# Altium schematic sheet Вариант7.SchDoc
size A4; SheetNumber: 7; SheetTotal: 10
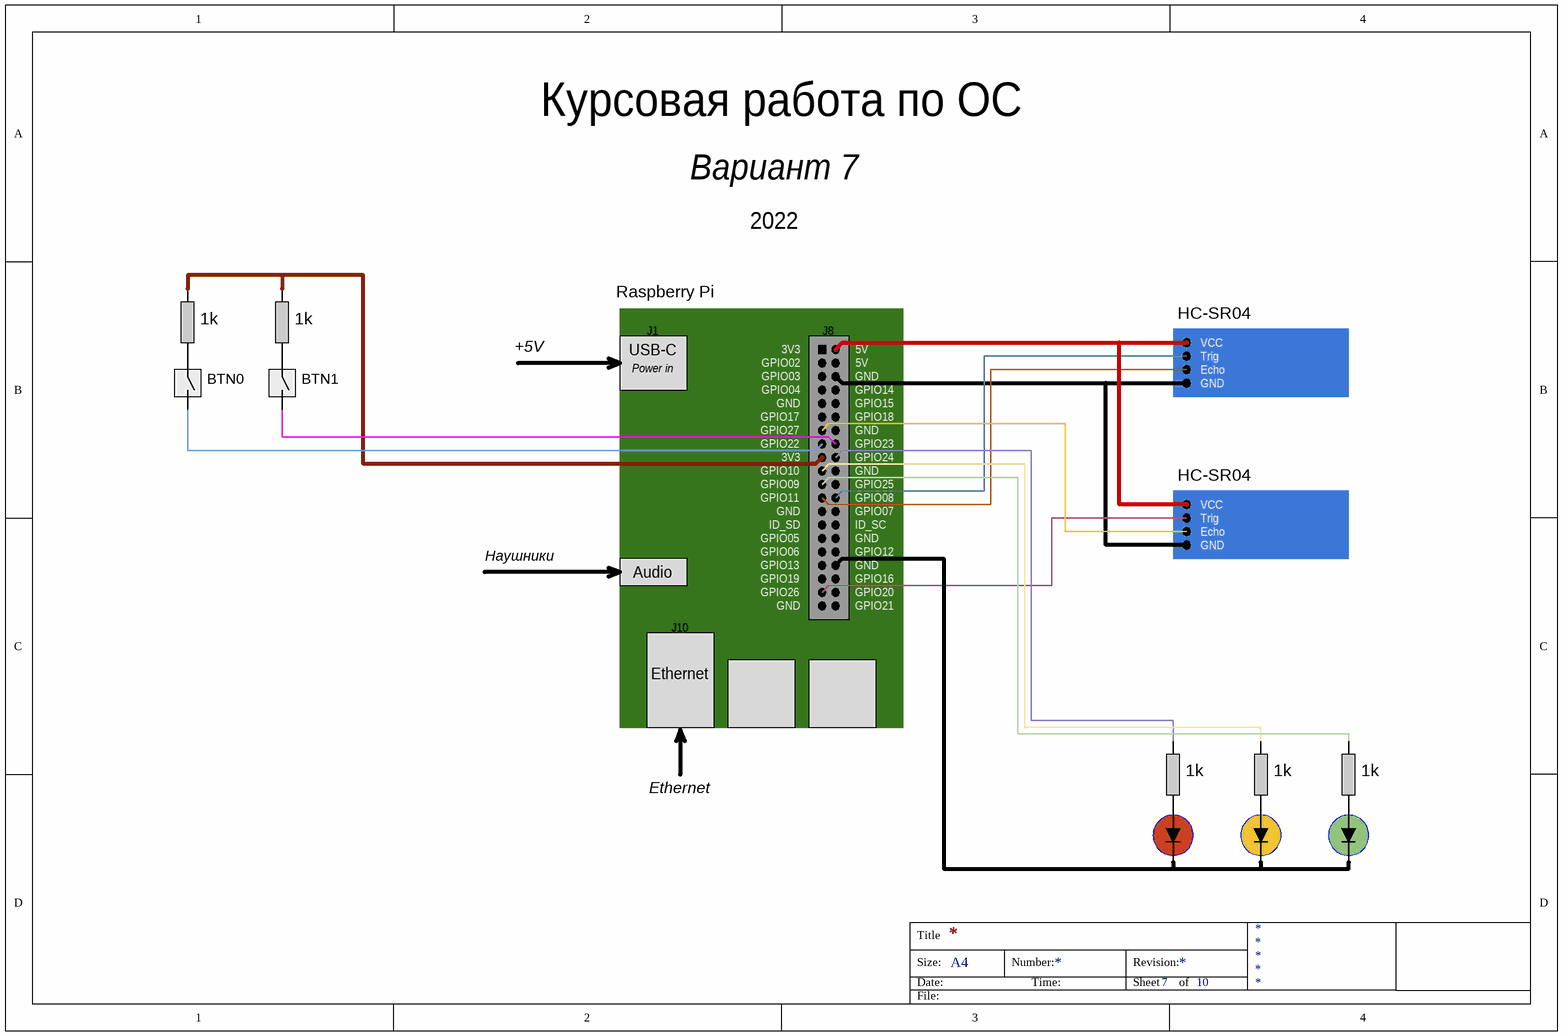
[diagram p0: Вариант7.SchDoc]

## Notes on the sheet
- Курсовая работа по ОС
- Вариант 7
- 2022
- 1k
- Raspberry Pi
- HC-SR04
- BTN0
- BTN1
- +5V
- USB-C
- Power in
- J1
- 3V3
- GPIO02
- GPIO03
- GPIO04
- J8
- GND
- GPIO14
- 5V
- VCC
- Trig
- Echo
- GPIO17
- GPIO27
- GPIO22
- GPIO15
- GPIO18
- GPIO23
- GPIO09
- GPIO10
- GPIO11
- ID_SD
- GPIO24
- GPIO25
- GPIO08
- GPIO07
- ID_SC
- Наушники
- Audio
- GPIO05
- GPIO06
- GPIO13
- GPIO19
- GPIO12
- GPIO16
- J10
- GPIO26
- GPIO20
- GPIO21
- Ethernet
- Title
- Size:
- Date:
- A4
- Number:
- Time:
- Revision:
- Sheet
- of
- File: